# Altium schematic sheet ESP32_WROOM2.SchDoc: ESP32 WROOM module schematic
size A4; Author: Pavel Nadelin; DrawnBy: Pavel Nadelin; Revision: 1.0; SheetNumber: 1; SheetTotal: 1
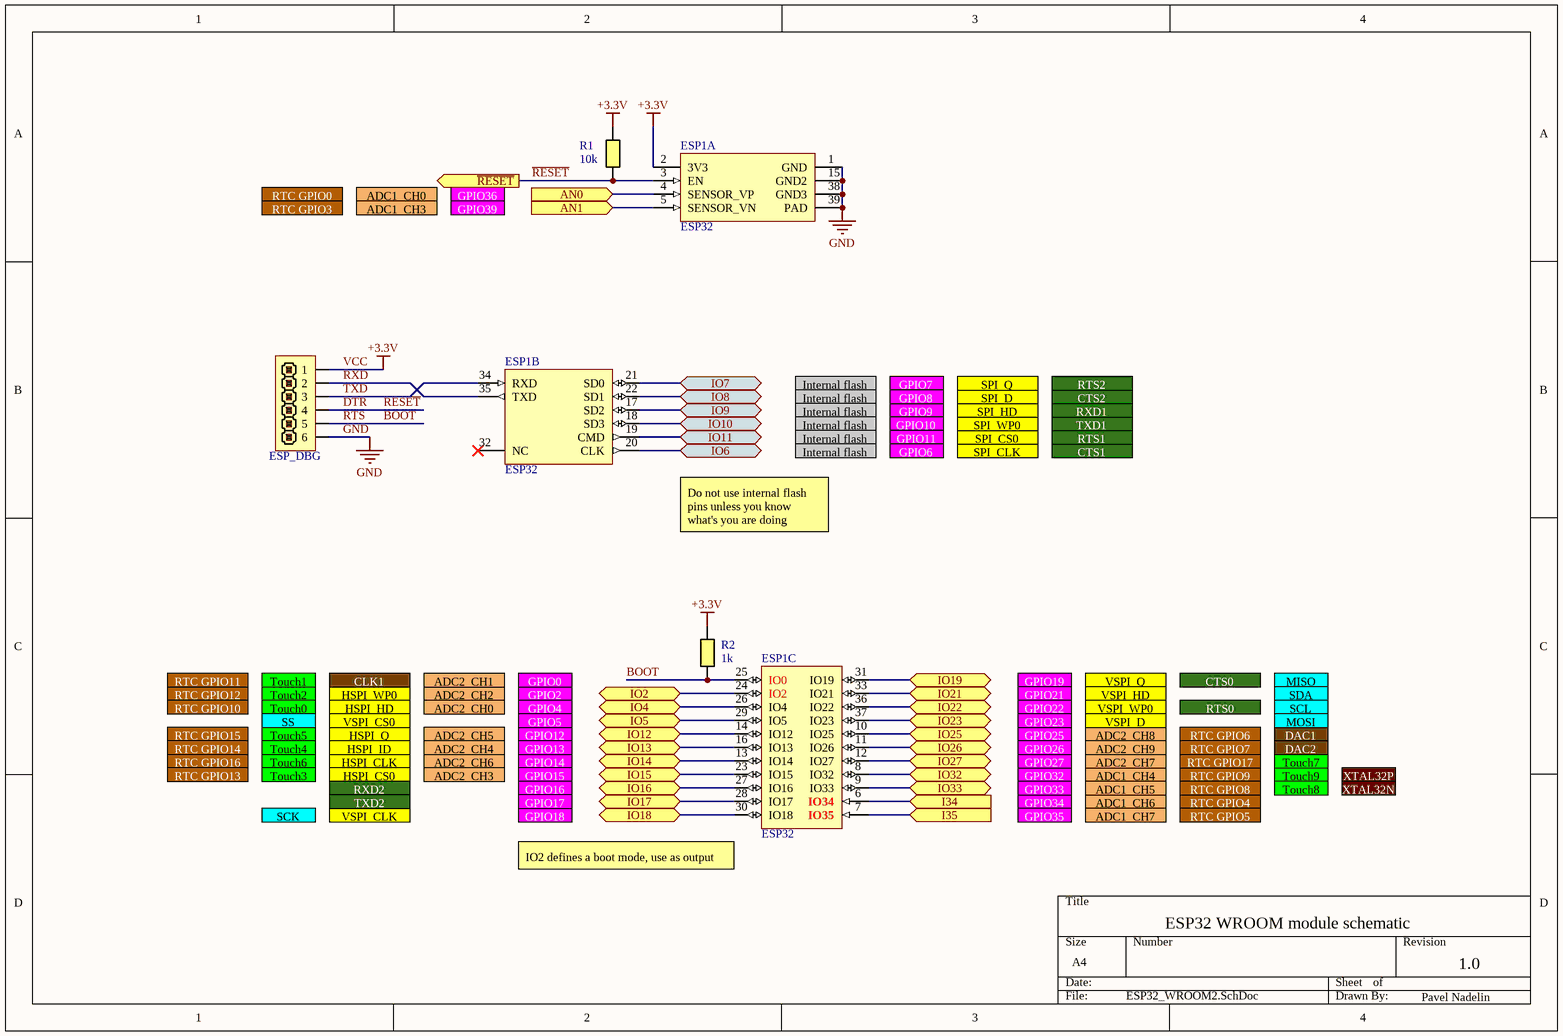
[diagram p0: ESP32_WROOM2.SchDoc]

## Parts
ESP1  ESP32  [ESP32-WROOM]  (parts A,B,C of 3)
ESP_DBG  PIN HEADER 1x6  [PIN HEADER SINGLE 6]  (value not drawn)
R1  10k  [RESC0603(1608)_N]
R2  1k  [RESC0603(1608)_N]

## Ports
AN0 (in), AN1 (in), I34 (in), I35 (in), IO2 (bidir), IO4 (bidir), IO5 (bidir), IO6 (bidir), IO7 (bidir), IO8 (bidir), IO9 (bidir), IO10 (bidir), IO11 (bidir), IO12 (bidir), IO13 (bidir), IO14 (bidir), IO15 (bidir), IO16 (bidir), IO17 (bidir), IO18 (bidir), IO19 (bidir), IO21 (bidir), IO22 (bidir), IO23 (bidir), IO25 (bidir), IO26 (bidir), IO27 (bidir), IO32 (bidir), IO33 (bidir), ~{RESET} (out)

## Nets
GND: ESP1.1(GND) ESP1.15(GND2) ESP1.38(GND3) ESP1.39(PAD) ESP_DBG.6
VCC: ESP1.2(3V3) ESP_DBG.1 R1.1 R2.1  [also labelled +3.3V]
AN0: ESP1.4(SENSOR_VP) ; port AN0
AN1: ESP1.5(SENSOR_VN) ; port AN1
BOOT: ESP1.25(IO0) ESP_DBG.5 R2.2  [also labelled RTS]
DTR: ESP1.3(EN) ESP_DBG.4 R1.2 ; port ~{RESET}  [also labelled ~{RESET}]
I34: ESP1.6(IO34) ; port I34
I35: ESP1.7(IO35) ; port I35
IO2: ESP1.24(IO2) ; port IO2
IO4: ESP1.26(IO4) ; port IO4
IO5: ESP1.29(IO5) ; port IO5
IO6: ESP1.20(CLK) ; port IO6
IO7: ESP1.21(SD0) ; port IO7
IO8: ESP1.22(SD1) ; port IO8
IO9: ESP1.17(SD2) ; port IO9
IO10: ESP1.18(SD3) ; port IO10
IO11: ESP1.19(CMD) ; port IO11
IO12: ESP1.14(IO12) ; port IO12
IO13: ESP1.16(IO13) ; port IO13
IO14: ESP1.13(IO14) ; port IO14
IO15: ESP1.23(IO15) ; port IO15
IO16: ESP1.27(IO16) ; port IO16
IO17: ESP1.28(IO17) ; port IO17
IO18: ESP1.30(IO18) ; port IO18
IO19: ESP1.31(IO19) ; port IO19
IO21: ESP1.33(IO21) ; port IO21
IO22: ESP1.36(IO22) ; port IO22
IO23: ESP1.37(IO23) ; port IO23
IO25: ESP1.10(IO25) ; port IO25
IO26: ESP1.11(IO26) ; port IO26
IO27: ESP1.12(IO27) ; port IO27
IO32: ESP1.8(IO32) ; port IO32
IO33: ESP1.9(IO33) ; port IO33
RXD: ESP1.35(TXD) ESP_DBG.2
TXD: ESP1.34(RXD) ESP_DBG.3

Not connected (* = marked no-connect by the designer): ESP1 32(NC)*

## Notes on the sheet
- RTC GPIO0
- RTC GPIO3
- ADC1_CH0
- ADC1_CH3
- GPIO36
- GPIO39
- Internal flash
- GPIO7
- SPI_Q
- RTS2
- GPIO9
- GPIO10
- GPIO11
- GPIO8
- SPI_CS0
- SPI_WP0
- SPI_HD
- SPI_D
- RTS1
- TXD1
- RXD1
- CTS2
- GPIO6
- SPI_CLK
- CTS1
- Do not use internal flash pins unless you know what's you are doing
- RTC GPIO12
- RTC GPIO11
- RTC GPIO10
- Touch2
- Touch1
- Touch0
- HSPI_WP0
- CLK1
- HSPI_HD
- ADC2_CH2
- ADC2_CH1
- ADC2_CH0
- GPIO2
- GPIO0
- GPIO4
- GPIO19
- GPIO21
- GPIO22
- VSPI_Q
- VSPI_HD
- VSPI_WP0
- CTS0
- RTS0
- MISO
- SDA
- SCL
- RTC GPIO16
- RTC GPIO15
- RTC GPIO14
- RTC GPIO13
- Touch6
- Touch5
- Touch4
- Touch3
- SS
- HSPI_CLK
- HSPI_Q
- HSPI_ID
- HSPI_CS0
- VSPI_CS0
- RXD2
- ADC2_CH6
- ADC2_CH5
- ADC2_CH4
- ADC2_CH3
- GPIO14
- GPIO12
- GPIO13
- GPIO15
- GPIO5
- GPIO16
- GPIO32
- GPIO33
- GPIO27
- GPIO25
- GPIO26
- GPIO23
- ADC1_CH4
- ADC1_CH5
- ADC2_CH7
- ADC2_CH8
- ADC2_CH9
- VSPI_D
- RTC GPIO9
- RTC GPIO8
- RTC GPIO17
- RTC GPIO6
- RTC GPIO7
- Touch9
- Touch8
- Touch7
- DAC1
- DAC2
- MOSI
- XTAL32P
- XTAL32N
- SCK
- VSPI_CLK
- TXD2
- GPIO18
- GPIO17
- GPIO34
- GPIO35
- ADC1_CH6
- ADC1_CH7
- RTC GPIO4
- RTC GPIO5
- (near ESP1) IO2 defines a boot mode, use as output

## Library data of the parts
ESP1 = ESP32S: ESP32-WROOM-32 is a powerful, generic Wi-Fi+BT+BLE MCU module
ESP_DBG = PIN HEADER 2.54 1x6
R1 R2 = Resistor M: Resistor Medium Density
  R1: Value: 10k
  R2: Value: 1k